# EAGLE design IOmodule (EAGLE 5.07)
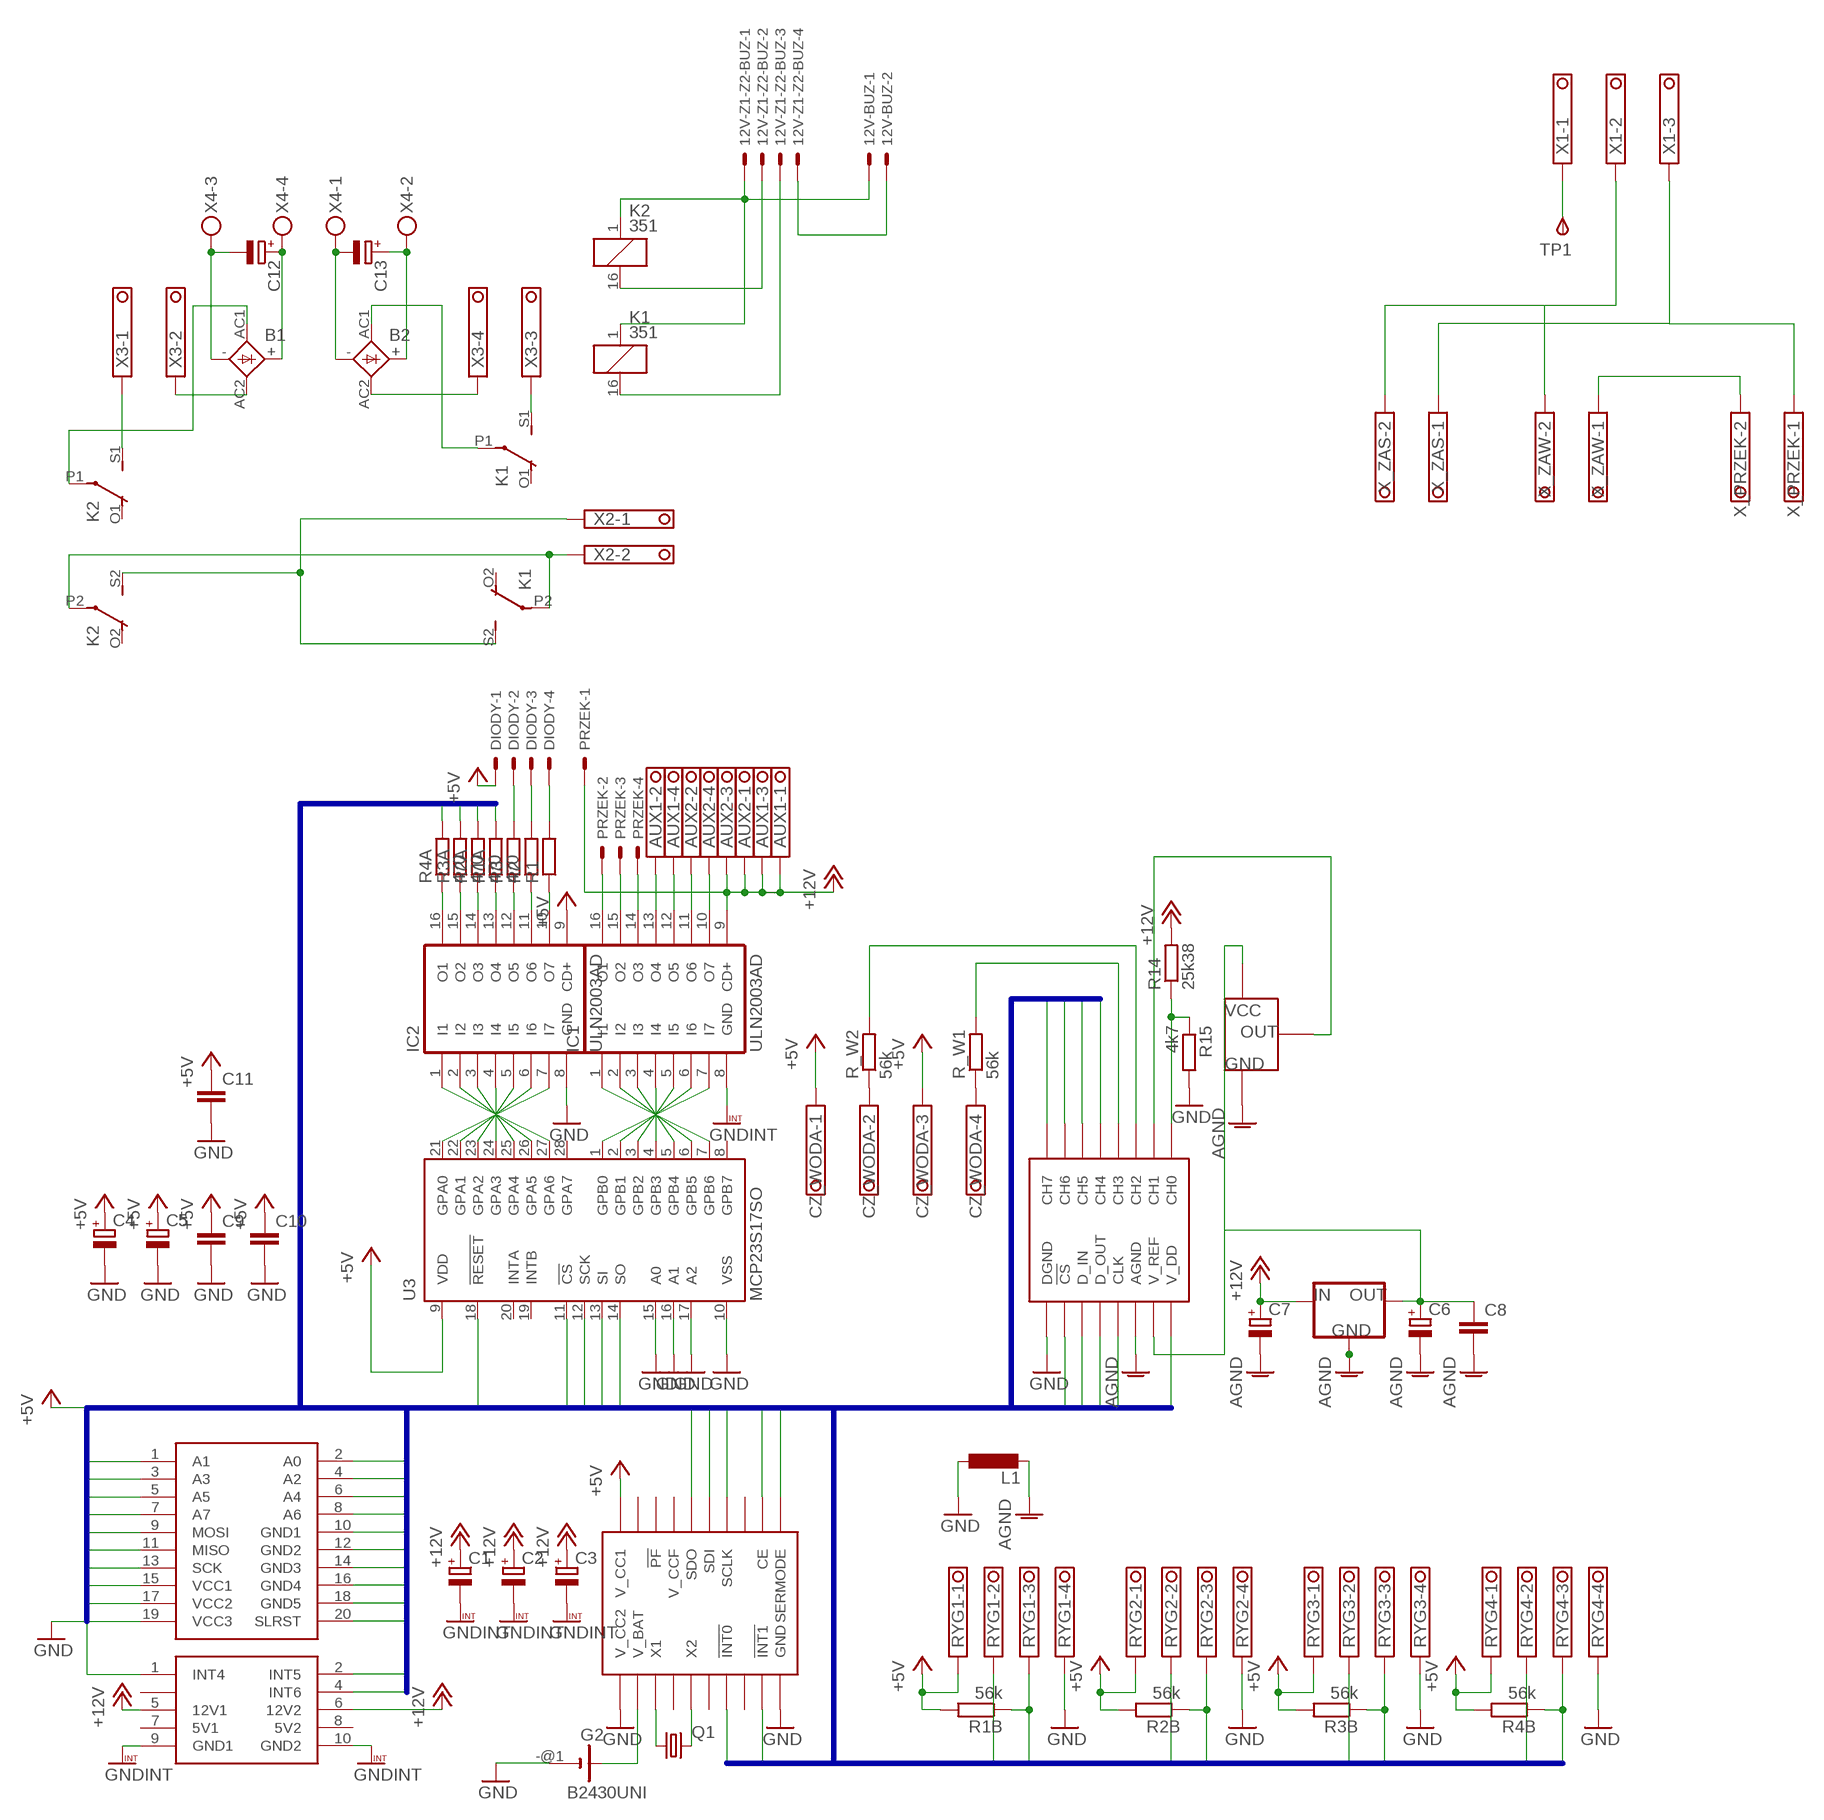
[diagram p0: schematic, sheet 1]

## Parts
12V-BUZ  22-23-2021  [22-23-2021]
12V-Z1-Z2-BUZ  22-23-2041  [22-23-2041]
AUX1  1751264  [1751264]
AUX2  1751264  [1751264]
B1  FB15  [FB15]
B2  FB15  [FB15]
C1  CPOL-EUE3.5-8  [E3,5-8]
C2  CPOL-EUE3.5-8  [E3,5-8]
C3  CPOL-EUE3.5-8  [E3,5-8]
C4  CPOL-EUC  [PANASONIC_C]
C5  CPOL-EUE3.5-8  [E3,5-8]
C6  CPOL-EUC  [PANASONIC_C]
C7  CPOL-EUC  [PANASONIC_C]
C8  C-EUC1206  [C1206]
C9  C-EUC1206  [C1206]
C10  C-EUC1206  [C1206]
C11  C-EUC1206  [C1206]
C12  CPOL-EUE5-13  [E5-13]
C13  CPOL-EUE5-13  [E5-13]
CZ_WODA  1751264  [1751264]
DIODY  22-23-2041  [22-23-2041]
EXT  MASTER_SPI_BUS  [ML20]
EXT2  MASTER_EXTERNAL  [ML10]
G2  B2430UNI  [B2430UNI]
IC1  ULN2003AD  [SO16]
IC2  ULN2003AD  [SO16]
K1  351  [351]
K2  351  [351]
L1  L-EUL2012C  [L2012C]
PRZEK  22-23-2041  [22-23-2041]
Q1  CRYSTALTC26H  [TC26H]
R1  R-EU_M3216  [M3216]
R1A  470  R-EU_R1206  [R1206]
R1B  56k  R-EU_R1206  [R1206]
R2  R-EU_M3216  [M3216]
R2A  470  R-EU_R1206  [R1206]
R2B  56k  R-EU_R1206  [R1206]
R3  R-EU_M3216  [M3216]
R3A  470  R-EU_R1206  [R1206]
R3B  56k  R-EU_R1206  [R1206]
R4A  470  R-EU_R1206  [R1206]
R4B  56k  R-EU_R1206  [R1206]
R14  25k38  R-EU_R1206  [R1206]
R15  4k7  R-EU_R1206  [R1206]
R_W1  56k  R-EU_R1206  [R1206]
R_W2  56k  R-EU_R1206  [R1206]
RTC  DS1305  [SSOP20]
RYG1  1751264  [1751264]
RYG2  1751264  [1751264]
RYG3  1751264  [1751264]
RYG4  1751264  [1751264]
S  LM35  [78LXX]
TP1  TPSPAD1-20  [P1-20]
U1  MCP3008  [SO16]
U2  78XXS08  [SO-08]
U3  MCP23S17SO  [SO28W]
X1  1751251  [1751251]
X2  1751248  [1751248]
X3  1751264  [1751264]
X4  MKDSN1,5/4-5,08  [MKDSN1,5/4-5,08]
X_PRZEK  1751248  [1751248]
X_ZAS  1751248  [1751248]
X_ZAW  1751248  [1751248]

## Nets
+5V: C4.+ C5.+ C9.1 C10.1 C11.1 CZ_WODA.1 CZ_WODA.3 DIODY.1 EXT.15(VCC1) EXT.17(VCC2) EXT.19(VCC3) IC2.9(CD+) R1B.2 R2B.2 R3B.2 R4B.2 RTC.11(SERMODE) RTC.20(V_CC1) RYG1.1 RYG2.1 RYG3.1 RYG4.1 U1.16(V_DD) U3.9(VDD)
+12V: AUX1.1 AUX1.3 AUX2.1 AUX2.3 C1.+ C2.+ C3.+ C7.+ EXT2.5(12V1) EXT2.6(12V2) IC1.9(CD+) PRZEK.1 R14.2 U2.8(IN)
A0: EXT.2(A0)
A1: EXT.1(A1)
A2: EXT.4(A2)
A3: EXT.3(A3)
A4: EXT.6(A4)
A5: EXT.5(A5) RTC.12(CE)
A5V: C6.+ C8.1 S.OUT(VCC) U1.15(V_REF) U2.1(OUT)
A6: EXT.8(A6) U1.10(!CS)
A7: EXT.7(A7) U3.11(!CS)
AC0: R14.1 R15.1 U1.1(CH0)
AC1: S.GND(OUT) U1.2(CH1)
AC2: R_W2.2 U1.3(CH2)
AC3: R_W1.2 U1.4(CH3)
AGND: C6.- C7.- C8.2 L1.2 S.IN(GND) U1.14(AGND) U2.2(GND1) U2.3(GND2) U2.6(GND) U2.7(GND3)
BUZZER_REL: IC1.14(O3) PRZEK.4
GND: C4.- C5.- C9.2 C10.2 C11.2 EXT.10(GND1) EXT.12(GND2) EXT.14(GND3) EXT.16(GND4) EXT.18(GND5) G2.-@1(-) IC2.8(GND) L1.1 R15.2 RTC.1(V_CC2) RTC.10(GND) RYG1.4 RYG2.4 RYG3.4 RYG4.4 U1.9(DGND) U3.10(VSS) U3.15(A0) U3.16(A1) U3.17(A2)
GNDINT: C1.- C2.- C3.- EXT2.9(GND1) EXT2.10(GND2) IC1.8(GND)
GPB0: IC1.7(I7) U3.1(GPB0)
GPB1: IC1.6(I6) U3.2(GPB1)
GPB2: IC1.5(I5) U3.3(GPB2)
GPB3: IC1.4(I4) U3.4(GPB3)
GPB4: IC1.3(I3) U3.5(GPB4)
GPB5: IC1.2(I2) U3.6(GPB5)
GPB6: IC1.1(I1) U3.7(GPB6)
INT4: EXT2.1(INT4) RTC.7(!INT0)
INT5: EXT2.2(INT5) RTC.9(!INT1)
INT6: EXT2.4(INT6)
MISO: EXT.11(MISO) RTC.16(SDO) U1.12(D_OUT) U3.14(SO)
MOSI: EXT.9(MOSI) RTC.15(SDI) U1.11(D_IN) U3.13(SI)
N$1: Q1.1 RTC.3(X1)
N$2: Q1.2 RTC.5(X2)
N$3: IC2.7(I7) U3.21(GPA0)
N$5: IC2.1(I1) U3.27(GPA6)
N$6: IC2.6(I6) U3.22(GPA1)
N$7: IC2.4(I4) U3.24(GPA3)
N$8: IC2.5(I5) U3.23(GPA2)
N$9: IC2.3(I3) U3.25(GPA4)
N$10: IC2.2(I2) U3.26(GPA5)
N$18: AUX1.2 IC1.13(O4)
N$19: AUX1.4 IC1.12(O5)
N$20: AUX2.2 IC1.11(O6)
N$21: AUX2.4 IC1.10(O7)
N$25: IC2.10(O7) R1.1
N$26: IC2.11(O6) R2.1
N$27: IC2.12(O5) R3.1
N$28: DIODY.4 R1.2
N$29: DIODY.3 R2.2
N$30: DIODY.2 R3.2
N$39: CZ_WODA.2 R_W2.1
N$40: CZ_WODA.4 R_W1.1
N$139: B1.AC2 X3.2
N$140: B2.AC2 X3.4
N$141: B1.- C12.- X4.3
N$142: B1.+ C12.+ X4.4
N$143: B2.- C13.- X4.1
N$144: B2.+ C13.+ X4.2
N$145: K1.S1(2:S) X3.3
N$146: B2.AC1 K1.P1(2:P)
N$147: K2.S1(2:S) X3.1
N$148: B1.AC1 K2.P1(2:P)
N$149: 12V-BUZ.1 12V-Z1-Z2-BUZ.1 K1.1 K2.1
N$150: 12V-Z1-Z2-BUZ.2 K2.16
N$151: 12V-Z1-Z2-BUZ.3 K1.16
N$152: K1.S2(3:S) K2.S2(3:S) X2.1
N$153: K1.P2(3:P) K2.P2(3:P) X2.2
N$154: 12V-BUZ.2 12V-Z1-Z2-BUZ.4
N$155: TP1.TP(PP) X1.1
N$156: X1.2 X_ZAS.2 X_ZAW.2
N$157: X1.3 X_PRZEK.1 X_ZAS.1
N$158: X_PRZEK.2 X_ZAW.1
RLK1: R1A.2 RYG1.2
RLK2: R2A.2 RYG2.2
RLK3: R3A.2 RYG3.2
RLK4: R4A.2 RYG4.2
RW1: R1B.1 RYG1.3 U1.8(CH7)
RW2: R2B.1 RYG2.3 U1.7(CH6)
RW3: R3B.1 RYG3.3 U1.6(CH5)
RW4: R4B.1 RYG4.3 U1.5(CH4)
SCK: EXT.13(SCK) RTC.14(SCLK) U1.13(CLK) U3.12(SCK)
SLRST: EXT.20(SLRST) U3.18(!RESET)
V_BAT: G2.+@4(+) RTC.2(V_BAT)
ZAW1_REL: IC1.16(O1) PRZEK.2
ZAW2_REL: IC1.15(O2) PRZEK.3
ZDR1: IC2.13(O4) R1A.1
ZDR2: IC2.14(O3) R2A.1
ZDR3: IC2.15(O2) R3A.1
ZDR4: IC2.16(O1) R4A.1
Unconnected: EXT2.3(NC) EXT2.7(5V1) EXT2.8(5V2) G2.- K1.O1(2:O) K1.O2(3:O) K2.O1(2:O) K2.O2(3:O) RTC.4(NC1) RTC.6(NC2) RTC.8(NC3) RTC.13(NC4) RTC.17(V_CCF) RTC.18(!PF) RTC.19(NC5) U3.8(GPB7) U3.19(INTB) U3.20(INTA) U3.28(GPA7)

## Buses
A[0..7],INT[4..6],MISO,MOSI,SCK,SLRST,GND,+5V,RLK[1..4],RW[1..4]

## Library data of the parts
12V-BUZ = con-molex:22-23-2021: .100" (2.54mm) Center Header - 2 Pin
12V-Z1-Z2-BUZ DIODY PRZEK = con-molex:22-23-2041: .100" (2.54mm) Center Header - 4 Pin
AUX1 AUX2 CZ_WODA RYG1-RYG4 X3 = con-phoenix-350:1751264: MKDS 1/ 4-3,5 Printklemme Nennstrom: 10 A Bemessungsspannung: 160 V Raster: 3,5 mm Polzahl: 4 Montageart: Löten Anschlussart: Schraubanschluss Anschlussrichtung vom Leiter zur Platine: 0° Source: http://eshop.phoenixcontact.com .. 1751264.pdf
B1 B2 = rectifier:FB15: FAGOR RECTIFIER grid 3 x 5 mm
C1-C7 C12 C13 = rcl:CPOL-EU: POLARIZED CAPACITOR, European symbol
C8-C11 = rcl:C-EU: CAPACITOR, European symbol
EXT = moje:MASTER_SPI_BUS: AtMega128 controller Spi Bus 1 A1 2 A0 3 A3 4 A2 5 A5 6 A4 7 A7 8 A6 9 MOSI 10 GND 11 MISO 12 GND 13 SCK 14 GND 15 VCC 16 GND 17 VCC 18 GND 19 VCC 20 RST
EXT2 = moje:MASTER_EXTERNAL
G2 = moje:B2430UNI: LI BATTERY
IC1 IC2 = uln-udn:ULN2003A: DRIVER ARRAY
K1 K2 = relay:351: RELAY 2 x switch, Omron
L1 = rcl:L-EU: INDUCTOR, European symbol
Q1 = crystal:CRYSTAL: CRYSTAL
R1 R1A R1B R2 R2A R2B R3 R3A R3B R4A R4B R14 R15 R_W1 R_W2 = rcl:R-EU_: RESISTOR, European symbol
RTC = moje:DS1305: I2C/Spi RTC with 96 bytes nvram.
S = moje:LM35
TP1 = testpad:TPS: TEST PIN
U1 = moje:MCP3008: 10bit 8 channel A/C with Spi interface.
U2 = moje:78XXS08
U3 = microchip:MCP23S17: http://ww1.microchip.com/downloads/en/DeviceDoc/21952a.pdf Source: http://ww1.microchip.com/downloads/en/DeviceDoc/21952a.pdf
X1 = con-phoenix-350:1751251: MKDS 1/ 3-3,5 Printklemme Nennstrom: 10 A Bemessungsspannung: 160 V Raster: 3,5 mm Polzahl: 3 Montageart: Löten Anschlussart: Schraubanschluss Anschlussrichtung vom Leiter zur Platine: 0° Source: http://eshop.phoenixcontact.com .. 1751251.pdf
X2 X_PRZEK X_ZAS X_ZAW = con-phoenix-350:1751248: MKDS 1/ 2-3,5 Printklemme Nennstrom: 10 A Bemessungsspannung: 160 V Raster: 3,5 mm Polzahl: 2 Montageart: Löten Anschlussart: Schraubanschluss Anschlussrichtung vom Leiter zur Platine: 0° Source: http://eshop.phoenixcontact.com .. 1751248.pdf
X4 = con-phoenix-508:MKDSN1,5/4-5,08: MKDSN 1,5/ 4-5,08 Printklemme Nennstrom: 13,5 A Nennspannung: 250 V Rastermaß: 5,08 mm Polzahl: 4 Anschlussart: Schraubanschluss Montage: Löten Anschlussrichtung Leiter/Platine: 0 ° Artikelnummer: 1729144 Source: http://eshop.phoenixcontact.com .. 1729144.pdf

## Board
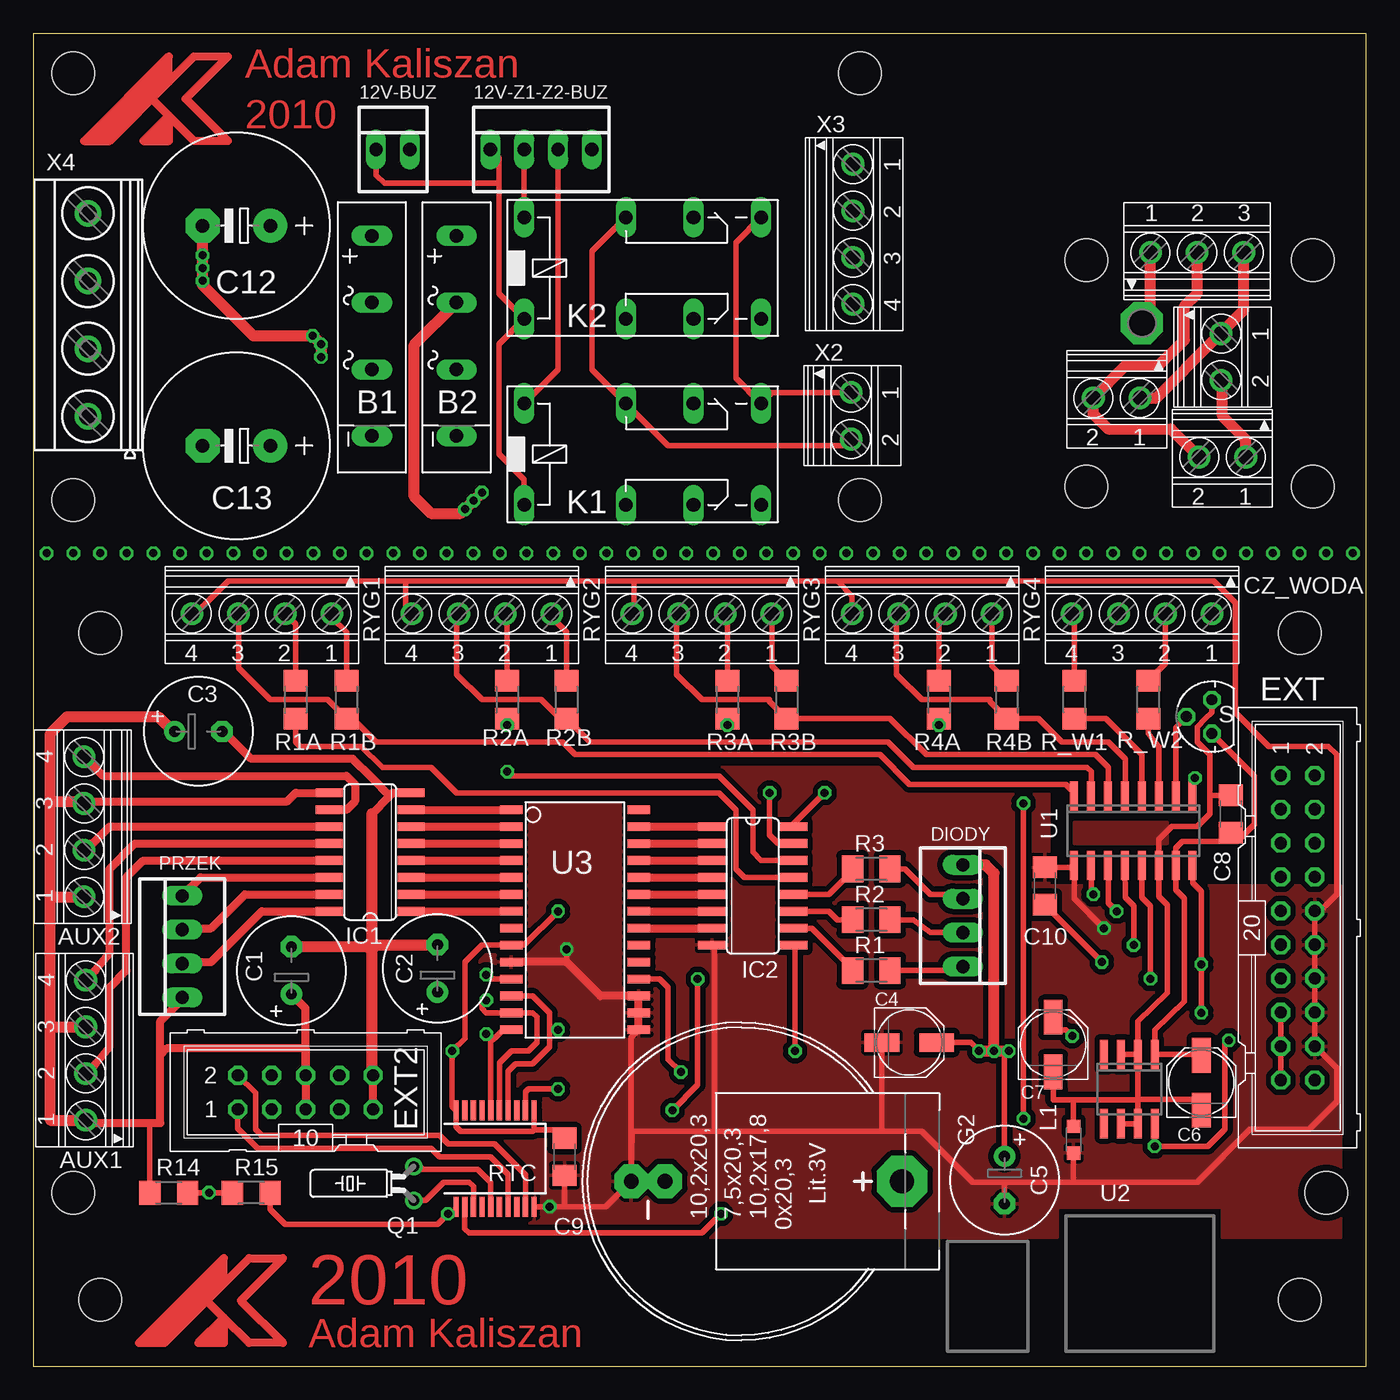
[diagram p1: board, top side]
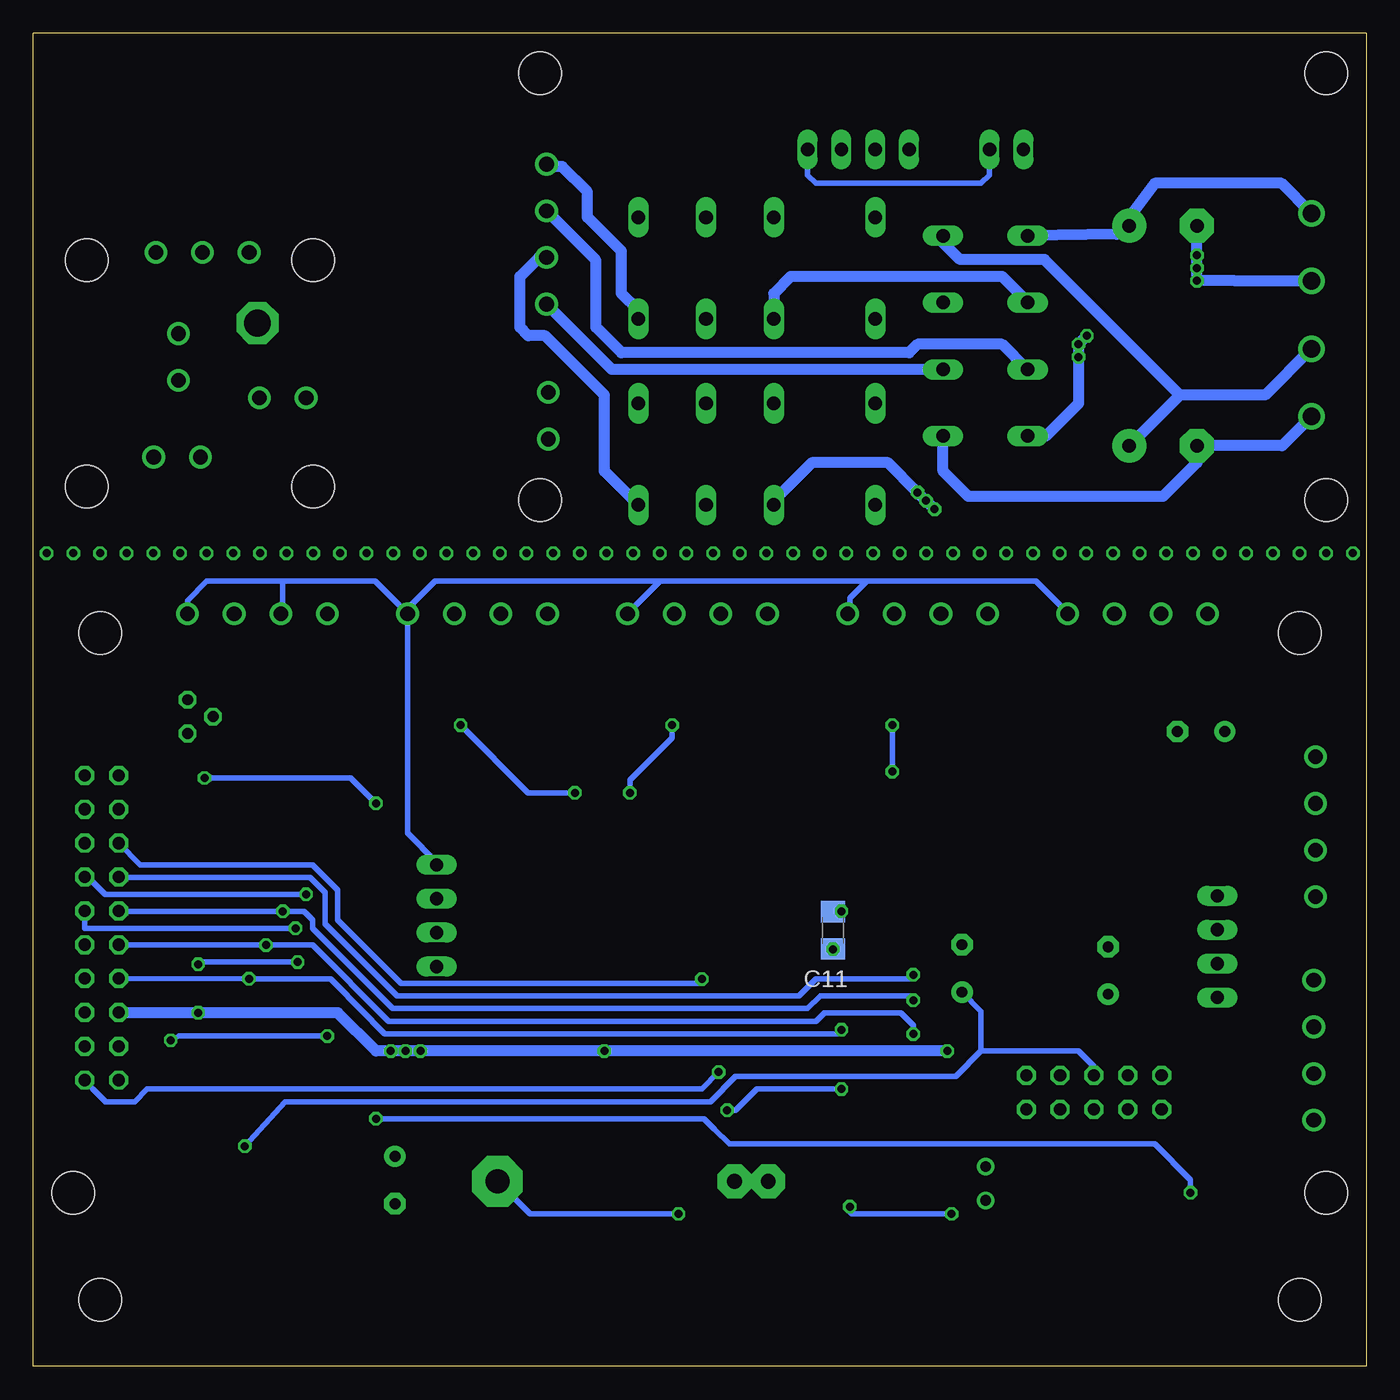
[diagram p2: board, bottom side, seen from below]

Size 100 x 100 mm. Coordinates in mm from the lower left corner, seen from the top.
Outline: 0,0 100,0 100,100 0,100 0,0
Copper layers (1*16): Top 0.035mm / dielectric 1.5mm / Bottom 0.035mm
Design rules "default *": minimum track width 8mil, minimum drill 16mil, track to track 8mil, track to pad 8mil, pad to pad 8mil, via to via 8mil, smd to smd 8mil, copper to edge 20mil, drill to drill 8mil, minimum pad ring 10mil, minimum via ring 8mil, stop-mask expansion 4mil, vias tented up to drill 0mil, thermal gap 10mil
Holes 3.2 mm at 3,13 5,55 95,55 97,13 5,5 95,5 3,65 62,65 3,97 62,97 96,66 96,83 79,83 79,66

### Footprints (pad centres in the part's own frame; a part is rotated, then mirrored left to right if it is on the bottom)
22-23-2021 = drill 1 long: 1 -1.27,0; 2 1.27,0
22-23-2041 = drill 1 long: 1 -3.81,0; 2 -1.27,0; 3 1.27,0; 4 3.81,0
1751264 = drill 1.1 pad 1.7 round: 1 -5.25,-0.1; 2 -1.75,-0.1; 3 1.75,-0.1; 4 5.25,-0.1
FB15 = drill 1.016 long: + -7.5,0; - 7.511,0; AC1 -2.496,0; AC2 2.533,0
E3,5-8 = drill 0.813 pad 1.6 round: + -1.778,0 | drill 0.813 pad 1.6 octagon: - 1.778,0
PANASONIC_C = smd 2.6 x 1.4: + 2.05,0; - -2.05,0
C1206 = smd 1.6 x 1.8: 1 -1.4,0; 2 1.4,0
E5-13 = drill 1.016 pad 2.54 round: + -2.54,0 | drill 1.016 pad 2.54 octagon: - 2.54,0
ML20 = drill 0.914 octagon: 1 -11.43,-1.27; 2 -11.43,1.27; 3 -8.89,-1.27; 4 -8.89,1.27; 5 -6.35,-1.27; 6 -6.35,1.27; 7 -3.81,-1.27; 8 -3.81,1.27; 9 -1.27,-1.27; 10 -1.27,1.27; 11 1.27,-1.27; 12 1.27,1.27; 13 3.81,-1.27; 14 3.81,1.27; 15 6.35,-1.27; 16 6.35,1.27; 17 8.89,-1.27; 18 8.89,1.27; 19 11.43,-1.27; 20 11.43,1.27
ML10 = drill 0.914 octagon: 1 -5.08,-1.27; 2 -5.08,1.27; 3 -2.54,-1.27; 4 -2.54,1.27; 5 0,-1.27; 6 0,1.27; 7 2.54,-1.27; 8 2.54,1.27; 9 5.08,-1.27; 10 5.08,1.27
B2430UNI = drill 1.803 pad 3.81 octagon: +@4 0,12.065 | drill 1.118 pad 2.54 octagon: - 0,-5.715; -@1 0,-8.255
SO16 = smd 0.66 x 2.032: 1 -4.445,-3.073; 2 -3.175,-3.073; 3 -1.905,-3.073; 4 -0.635,-3.073; 5 0.635,-3.073; 6 1.905,-3.073; 7 3.175,-3.073; 8 4.445,-3.073; 9 4.445,3.073; 10 3.175,3.073; 11 1.905,3.073; 12 0.635,3.073; 13 -0.635,3.073; 14 -1.905,3.073; 15 -3.175,3.073; 16 -4.445,3.073
351 = drill 1.016 long: 1 -3.81,-3.81; 16 -3.81,3.81; O1 8.89,-3.81; O2 8.89,3.81; P1 3.81,-3.81; P2 3.81,3.81; S1 13.97,-3.81; S2 13.97,3.81
L2012C = smd 1 x 1: 1 -1,0; 2 1,0
TC26H = drill 0.813 round: 1 -1.27,0; 2 1.27,0
M3216 = smd 1.6 x 2: 1 -1.4,0; 2 1.4,0
R1206 = smd 1.6 x 1.803: 1 -1.422,0; 2 1.422,0
SSOP20 = smd 0.4 x 1.5: 1 -2.925,-3.625; 2 -2.275,-3.625; 3 -1.625,-3.625; 4 -0.975,-3.625; 5 -0.325,-3.625; 6 0.325,-3.625; 7 0.975,-3.625; 8 1.625,-3.625; 9 2.275,-3.625; 10 2.925,-3.625; 11 2.925,3.625; 12 2.275,3.625; 13 1.625,3.625; 14 0.975,3.625; 15 0.325,3.625; 16 -0.325,3.625; 17 -0.975,3.625; 18 -1.625,3.625; 19 -2.275,3.625; 20 -2.925,3.625
78LXX = drill 0.813 octagon: GND 0,1.905; IN 1.27,0; OUT -1.27,0
P1-20 = drill 2.007 pad 3.15 octagon: TP 0,0
SO16' = smd 0.6 x 2.2: 1 -4.445,-2.6; 2 -3.175,-2.6; 3 -1.905,-2.6; 4 -0.635,-2.6; 5 0.635,-2.6; 6 1.905,-2.6; 7 3.175,-2.6; 8 4.445,-2.6; 9 4.445,2.6; 10 3.175,2.6; 11 1.905,2.6; 12 0.635,2.6; 13 -0.635,2.6; 14 -1.905,2.6; 15 -3.175,2.6; 16 -4.445,2.6
SO-08 = smd 0.6 x 2.2: 1 -1.905,-2.6; 2 -0.635,-2.6; 3 0.635,-2.6; 4 1.905,-2.6; 5 1.905,2.6; 6 0.635,2.6; 7 -0.635,2.6; 8 -1.905,2.6
SO28W = smd 0.65 x 1.7: 1 -7.62,-4.78; 2 -6.35,-4.78; 3 -5.08,-4.78; 4 -3.81,-4.78; 5 -2.54,-4.78; 6 -1.27,-4.78; 7 0,-4.78; 8 1.27,-4.78; 9 2.54,-4.78; 10 3.81,-4.78; 11 5.08,-4.78; 12 6.35,-4.78; 13 7.62,-4.78; 14 8.89,-4.78; 15 8.89,4.78; 16 7.62,4.78; 17 6.35,4.78; 18 5.08,4.78; 19 3.81,4.78; 20 2.54,4.78; 21 1.27,4.78; 22 0,4.78; 23 -1.27,4.78; 24 -2.54,4.78; 25 -3.81,4.78; 26 -5.08,4.78; 27 -6.35,4.78; 28 -7.62,4.78
1751251 = drill 1.1 pad 1.7 round: 1 -3.5,-0.1; 2 0,-0.1; 3 3.5,-0.1
1751248 = drill 1.1 pad 1.7 round: 1 -1.75,-0.1; 2 1.75,-0.1
MKDSN1,5/4-5,08 = drill 1.3 pad 2 round: 1 -7.641,0.025; 2 -2.561,0.025; 3 2.519,0.025; 4 7.599,0.025

### Placement (x,y rotation side)
12V-BUZ  26.99,91.28 0 top
12V-Z1-Z2-BUZ  38.1,91.28 0 top
AUX1  3.83,23.71 90 top
AUX2  3.7,40.47 90 top
B1  25.4,77.31 270 top
B2  31.75,77.31 270 top
C1  19.37,29.68 90 top
C2  30.32,29.84 90 top
C3  12.38,47.62 0 top
C4  65.72,24.29 0 top
C5  72.87,13.97 270 top
C6  87.63,21.27 90 top
C7  76.52,24.13 90 top
C8  89.85,41.43 90 top
C9  39.85,15.72 270 top
C10  75.88,36.03 90 top
C11  40.01,32.7 270 bottom
C12  15.24,85.56 180 top
C13  15.24,69.06 180 top
CZ_WODA  83.19,56.35 180 top
DIODY  69.74,33.8 270 top
EXT  94.86,32.89 270 top
EXT2  20.42,20.55 0 top
G2  53.12,13.87 270 top
IC1  25.28,38.58 90 top
IC2  53.98,36.03 270 top
K1  40.64,68.42 0 top
K2  40.64,82.39 0 top
L1  78.05,17 90 top
PRZEK  11.17,31.47 90 top
Q1  28.55,13.71 90 top
R1  62.87,29.68 0 top
R1A  19.68,50.01 90 top
R1B  23.5,50.01 90 top
R2  62.87,33.5 0 top
R2A  35.56,50.01 90 top
R2B  40.01,50.01 90 top
R3  62.87,37.3 0 top
R3A  52.07,50.01 90 top
R3B  56.52,50.01 90 top
R4A  67.94,50.01 90 top
R4B  73.03,50.01 90 top
R14  10.16,13.02 180 top
R15  16.35,13.02 0 top
R_W1  78.11,50.01 270 top
R_W2  83.66,50.01 270 top
RTC  34.64,15.58 0 top
RYG1  17.14,56.35 180 top
RYG2  33.66,56.35 180 top
RYG3  50.16,56.35 180 top
RYG4  66.67,56.35 180 top
S  88.42,48.73 90 top
TP1  83.19,78.26 0 top
U1  MCP3008  [SO16']  82.53,40.16 180 top
U2  82.23,20.8 180 top
U3  40.64,34.13 270 top
U$5  [LOGO]  14.29,2.38 0 top
U$6  [LOGO]  10.16,92.55 0 top
X1  87.31,83.66 0 top
X2  61.45,71.31 270 top
X3  61.59,84.93 270 top
X4  4.13,78.9 90 top
X_PRZEK  89.22,75.72 270 top
X_ZAS  81.28,72.55 180 top
X_ZAW  89.22,68.1 180 top

### Tracks (layer width: path | path; a pad name or v marks a point on that pad's centre or on a via)
+5V  (via drill 0.6)
  Top 0.406: 40.01,51.27 R2B.2 40.01,55.09 38.91,56.19 RYG2.1 | R1B.2 23.5,55.09 22.39,56.19 RYG1.1 | R3B.2 55.41,52.53 RYG3.1 | R4B.2 71.92,52.53 RYG4.1 | 37.57,17.72 RTC.11 | 37.57,17.72 37.47,17.62 32.07,17.62 31.72,17.97 RTC.20 31.43,19.5 v31.43,23.65 32.38,24.61 32.38,30.32 33.66,31.59 U3.9 36.83,31.59 v39.37,34.13 | EXT.19 EXT.17 EXT.15 | U1.16 87,36.27 87.63,35.64 v87.63,30.16 v87.63,26.51 | IC2.9 57.15,31.49 v57.15,23.65 | C4.+ 70.33,24.29 v70.96,23.65 | C5.+ 72.87,23.34 v73.18,23.65 | C10.1 75.88,34.61 v80.17,30.32 | 37.57,17.72 39.24,17.72 C9.1
  Top 0.813: DIODY.1 69.76,37.62 71.44,37.62 72.07,36.99 v72.07,23.65 | v70.96,23.65 v72.07,23.65 | v72.07,23.65 v73.18,23.65
  Bottom 0.406: RYG1.1 22.86,56.99 24.77,58.9 37.47,58.9 | 37.47,58.9 38.73,57.62 38.73,56.62 RYG2.1 | 52.98,58.9 RYG3.1 | 52.98,58.9 37.47,58.9 | RYG4.1 71.75,56.62 71.75,56.99 69.85,58.9 52.98,58.9 | RYG4.1 74.36,58.9 81.28,58.9 | 81.28,58.9 87,58.9 88.44,57.45 CZ_WODA.1 | CZ_WODA.3 81.28,56.61 81.28,58.9 | EXT.15 93.56,26.51 93.66,26.51 | RYG4.1 71.92,39.99 69.74,37.81 DIODY.1 | v80.17,30.32 87.47,30.32 v87.63,30.16 | v39.37,34.13 39.98,34.13 C11.1
  Bottom 0.813: 93.56,26.51 v87.63,26.51 77.15,26.51 74.3,23.65 v73.18,23.65 v72.07,23.65 v70.96,23.65 v57.15,23.65 v31.43,23.65
+12V  (via drill 0.6)
  Top 0.406: 20.43,23.87 20.32,23.76 20.32,21.75 | U2.8 v84.14,16.51 88.11,16.51 89.38,17.78 89.38,24.45 v89.69,24.45 | R14.2 8.74,18.09 8.57,18.26 | C7.+ 76.68,26.18 76.68,25.24 77.47,25.24 v77.95,24.76
  Top 0.61: IC1.9 19.68,43.02 19.05,42.38 3.96,42.38 AUX2.3 | EXT2.5 EXT2.6 20.43,23.87 | 9.53,23.34 9.53,18.26 8.57,18.26 4.13,18.26 AUX1.1 | 9.53,23.34 10.05,23.87 20.43,23.87 | PRZEK.1 11.17,27.52 9.53,25.88 9.53,23.34 | 20.43,23.87 20.43,26.85 C1.+
  Top 0.813: AUX1.1 1.27,18.46 1.27,25.46 | 1.27,25.46 1.27,35.22 | 1.27,42.38 3.8,42.38 AUX2.3 | 1.27,35.22 AUX2.1 | 1.27,35.22 1.27,42.38 | 1.27,25.46 AUX1.3 | C3.+ 10.48,47.62 9.37,48.73 2.54,48.73 1.27,47.47 1.27,42.38
  Bottom 0.406: v84.14,16.51 81.12,19.84 49.21,19.84 47.31,21.75 30.8,21.75 28.89,23.65 | 28.89,23.65 21.59,23.65 20.43,22.49 EXT2.6 | 28.89,23.65 28.89,26.64 C2.+ | v77.95,24.76 89.06,24.76 v89.69,24.45
A5  (via drill 0.6)
  Top 0.406: v49.85,29.05 49.85,21.11 v47.94,19.21 | v39.37,20.8 37.15,20.8 36.92,20.57 RTC.12
  Bottom 0.406: EXT.5 91.97,37.62 79.06,37.62 77.15,35.72 77.15,33.5 72.39,28.73 50.48,28.73 50.16,28.73 v49.85,29.05 | v47.94,19.21 47.31,19.21 45.72,20.8 v39.37,20.8
A5V
  Top 0.406: 89.85,39.37 86.2,39.37 85.7,38.87 U1.15 85.72,37.54 85.72,35.72 86.36,35.08 86.36,34.45 86.34,27.39 84.14,25.24 U2.1 87.63,23.39 C6.+ | 89.85,39.37 90.33,39.37 91.6,40.64 91.6,44.29 S.OUT | S.OUT | 89.85,39.37 C8.1
A6  (via drill 0.6)
  Top 0.406: U1.10 79.38,35.64 v79.53,35.4
  Bottom 0.406: v79.53,35.4 94.61,35.4 95.92,36.7 EXT.8
A7  (via drill 0.6)
  Top 0.406: v33.97,29.37 34.29,29.05 U3.11
  Bottom 0.406: EXT.7 93.56,36.67 79.22,36.67 78.11,35.56 78.11,33.18 72.71,27.78 42.55,27.78 41.27,29.05 34.29,29.05 v33.97,29.37
AC0  (via drill 0.6)
  Top 0.406: R14.1 v13.18,13.02 R15.1 | U1.1 86.97,43.79 v87.15,44.13 | v74.3,42.23 74.3,40 74.3,39.21 74.3,21.43 v74.3,18.57
  Bottom 0.406: v87.15,44.13 76.2,44.13 v74.3,42.23 | v74.3,18.57 49.69,18.57 48.9,17.78 | 48.9,17.78 | 48.9,17.78 47.78,16.67 15.88,16.67 13.18,13.97 v13.18,13.02
AC1
  Top 0.406: U1.2 85.7,47.92 S.GND
AC2
  Top 0.406: R_W2.2 83.66,48.73 83.66,47.47 84.14,46.83 84.45,46.51 84.45,43.97 84.43,43.95 U1.3
AC3
  Top 0.406: U1.4 83.19,43.42 83.19,45.88 80.48,48.58 R_W1.2
AGND
  Top 0.406: U2.2 82.87,25.88 85.07,28.02 85.09,32.7 85.09,34.61 84.45,35.24 84.45,37.54 U1.14 84.43,39.5 85.41,40.48 87.31,40.48 88.27,41.43 88.27,42.86 | U2.2 U2.3 | 82.87,20 82.87,19.68 U2.7 U2.6 | 82.87,20 U2.2 | L1.2 78.05,20 | 78.05,20 82.87,20 | 88.27,42.86 88.27,45.88 87.31,46.83 87.31,47.94 87.95,48.58 | 87.95,48.58 | 87.95,48.58 88.42,49.05 S.IN | S.IN | 78.05,20 76.52,20 C7.- | C6.- 87.15,19.22 87.15,20 82.87,20 | C8.2 88.29,42.83 88.27,42.86
  pour Top: 85.09,39.21 78.11,39.21 78.11,40.8 85.09,40.8
BUZZER_REL
  Top 0.61: IC1.14 12.55,36.67 PRZEK.4
GND  (via drill 0.6)
  Top 0.406: RYG1.4 11.79,56.35 12.06,56.35 14.61,58.9 27.94,58.9 | RYG2.4 27.94,56.92 27.94,58.9 | 45.09,58.9 27.94,58.9 | 60.33,58.9 45.09,58.9 | 60.33,58.9 61.42,57.8 RYG4.4 | RYG3.4 45.09,56.62 45.09,58.9 | G2.-@1 42.95,11.96 39.85,11.96 | RTC.10 v38.73,11.96 39.85,11.96 | 60.33,58.9 88.58,58.9 90.17,57.31 90.17,49.05 92.71,46.51 97.16,46.51 97.79,45.88 97.79,35.4 96.55,34.16 EXT.10 EXT.12 EXT.14 EXT.16 EXT.18 96.17,24 97.79,22.38 97.79,19.84 95.73,17.78 91.28,17.78 87.31,13.81 78.05,13.81 | G2.-@1 44.86,24.68 U3.15 | 51.12,17.62 44.92,17.62 G2.-@1 | 51.12,17.62 63.5,17.62 | 63.5,17.62 66.67,17.62 70.48,13.81 72.87,13.81 | 72.87,13.81 78.05,13.81 | v80.33,32.86 78.11,35.08 78.11,37.54 U1.9 77.95,37.44 C10.2 | 78.05,13.81 L1.1 | IC2.8 51.12,31.37 51.12,17.62 | RTC.1 31.59,11.52 v31.11,11.43 30.32,10.63 18.89,10.63 17.77,11.75 R15.2 | C4.- 63.67,17.79 63.5,17.62 | 72.87,13.81 C5.- | 39.85,11.96 C9.2 | 39.85,11.96 | 40.01,30.32 v40.01,31.27
  Top 0.61: U3.15 U3.16 U3.17 42.55,27.78 40.01,30.32 U3.10
  Bottom 0.406: v80.33,32.86 96.13,32.86 EXT.10 | v31.11,11.43 38.58,11.43 38.73,11.59 v38.73,11.96 | C11.2 39.98,31.46 v40.01,31.27
  pour Top (isolate 0.406): 33.66,44.92 33.34,9.68 76.83,9.68 76.83,11.9 89.22,11.9 89.22,9.68 98.11,9.68 98.11,36.03 76.2,36.03 76.2,44.92
GNDINT
  Top 0.406: EXT2.10 25.4,21.92
  Top 0.61: IC1.8 26.99,43.02 26.75,42.78 | 25.4,41.43 26.75,42.78 | EXT2.9 EXT2.10 | C3.- 14.29,47.62 16.35,45.56 23.97,45.56 25.4,44.13 26.75,42.78
  Top 0.813: 25.4,21.92 25.4,31.11 | 25.4,31.11 25.4,31.27 | 25.4,31.27 25.4,41.43 | C1.- 25.05,31.46 25.4,31.11 | C2.- 25.75,31.62 25.4,31.27
GPB0
  Top 0.61: IC1.7 U3.1
GPB1
  Top 0.61: IC1.6 U3.2
GPB2
  Top 0.61: IC1.5 U3.3
GPB3
  Top 0.61: IC1.4 U3.4
GPB4
  Top 0.61: IC1.3 U3.5
GPB5
  Top 0.61: IC1.2 U3.6
GPB6
  Top 0.61: IC1.1 U3.7
INT4
  Top 0.406: RTC.7 35.62,14.39 34.29,15.71 30.48,15.71 29.84,16.35 16.83,16.35 15.35,17.83 EXT2.1
INT5
  Top 0.406: RTC.9 36.92,14.36 34.61,16.67 31.11,16.67 30.48,17.3 17.14,17.3 16.67,17.78 16.67,20.49 EXT2.2
MISO  (via drill 0.6)
  Top 0.406: RTC.16 34.32,24.32 34.61,24.61 | 34.61,24.61 35.24,25.24 U3.14 | v33.97,24.92 34.29,24.61 34.61,24.61 | U1.12 81.92,35.16 82.55,34.52 v82.55,31.59
  Bottom 0.406: EXT.11 93.56,31.59 v82.55,31.59 79.06,31.59 73.34,25.88 41.27,25.88 40.64,26.51 34.92,26.51 33.97,25.56 v33.97,24.92
MOSI  (via drill 0.6)
  Top 0.406: RTC.15 34.97,22.74 35.88,23.65 37.15,23.65 37.78,24.29 37.78,26.19 37.47,26.51 U3.13 33.97,26.51 33.66,26.83 33.66,27.14 v33.97,27.46 | U1.11 80.64,37.54 80.64,34.77 v81.28,34.13
  Bottom 0.406: EXT.9 93.56,34.13 v81.28,34.13 79.69,34.13 79.06,33.5 79.06,32.86 73.03,26.83 41.91,26.83 40.96,27.78 34.29,27.78 v33.97,27.46
N$1
  Top 0.406: RTC.3 33.02,13.49 32.7,13.81 30.8,13.81 29.43,12.44 Q1.1
N$2
  Top 0.406: Q1.2 28.65,15.08 28.89,15.08 29.21,14.76 33.34,14.76 34.29,13.81 34.29,12.86 34.32,12.83 RTC.5
N$3
  Top 0.61: U3.21 IC2.7
N$5
  Top 0.61: U3.27 IC2.1
N$6
  Top 0.61: U3.22 IC2.6
N$7
  Top 0.61: U3.24 IC2.4
N$8
  Top 0.61: U3.23 IC2.5
N$9
  Top 0.61: U3.25 IC2.3
N$10
  Top 0.61: U3.26 IC2.2
N$18
  Top 0.61: IC1.13 8.26,37.94 6.99,36.67 6.99,29.68 5.71,28.41 5.71,23.97 4.67,22.7 AUX1.2
N$19
  Top 0.61: IC1.12 7.62,39.21 5.71,37.3 5.71,30.95 4.65,29.68 AUX1.4
N$20
  Top 0.61: IC1.11 5.71,40.48 4.45,39.21 4.29,39.21 AUX2.2
N$21
  Top 0.61: IC1.10 23.5,41.75 24.13,42.38 24.13,43.66 23.5,44.29 5.24,44.29 AUX2.4
N$25
  Top 0.406: IC2.10 58.42,32.86 61.47,29.82 R1.1
N$26
  Top 0.406: IC2.11 59.69,34.13 60.33,33.5 R2.1
N$27
  Top 0.406: IC2.12 59.69,35.4 61.47,37.17 R3.1
N$28
  Top 0.406: DIODY.4 69.44,29.68 R1.2
N$29
  Top 0.406: DIODY.3 67.31,32.53 66.04,33.5 64.14,33.5 64.27,33.36 R2.2
N$30
  Top 0.406: DIODY.2 69.41,35.4 67.31,35.4 65.41,37.3 R3.2
N$36  (via drill 0.6)
  other vias: 1,61
N$37  (via drill 0.6)
  other vias: 3,61
N$38  (via drill 0.6)
  other vias: 5,61
N$39
  Top 0.406: CZ_WODA.2 85.09,56.3 84.93,56.14 84.93,52.7 R_W2.1
N$40
  Top 0.406: CZ_WODA.4 78.11,56.28 R_W1.1
N$43  (via drill 0.6)
  other vias: 7,61
N$44  (via drill 0.6)
  other vias: 9,61
N$45  (via drill 0.6)
  other vias: 11,61
N$46  (via drill 0.6)
  other vias: 13,61
N$54  (via drill 0.6)
  other vias: 15,61
N$56  (via drill 0.6)
  other vias: 17,61
N$58  (via drill 0.6)
  other vias: 19,61
N$60  (via drill 0.6)
  other vias: 21,61
N$62  (via drill 0.6)
  other vias: 23,61
N$64  (via drill 0.6)
  other vias: 25,61
N$66  (via drill 0.6)
  other vias: 27,61
N$68  (via drill 0.6)
  other vias: 29,61
N$70  (via drill 0.6)
  other vias: 31,61
N$72  (via drill 0.6)
  other vias: 33,61
N$74  (via drill 0.6)
  other vias: 35,61
N$76  (via drill 0.6)
  other vias: 37,61
N$78  (via drill 0.6)
  other vias: 39,61
N$80  (via drill 0.6)
  other vias: 41,61
N$82  (via drill 0.6)
  other vias: 43,61
N$84  (via drill 0.6)
  other vias: 45,61
N$86  (via drill 0.6)
  other vias: 47,61
N$88  (via drill 0.6)
  other vias: 49,61
N$90  (via drill 0.6)
  other vias: 51,61
N$92  (via drill 0.6)
  other vias: 53,61
N$94  (via drill 0.6)
  other vias: 55,61
N$96  (via drill 0.6)
  other vias: 57,61
N$98  (via drill 0.6)
  other vias: 59,61
N$100  (via drill 0.6)
  other vias: 61,61
N$102  (via drill 0.6)
  other vias: 63,61
N$104  (via drill 0.6)
  other vias: 65,61
N$106  (via drill 0.6)
  other vias: 67,61
N$108  (via drill 0.6)
  other vias: 69,61
N$110  (via drill 0.6)
  other vias: 71,61
N$111  (via drill 0.6)
  other vias: 73,61
N$114  (via drill 0.6)
  other vias: 75,61
N$116  (via drill 0.6)
  other vias: 77,61
N$118  (via drill 0.6)
  other vias: 79,61
N$120  (via drill 0.6)
  other vias: 81,61
N$122  (via drill 0.6)
  other vias: 83,61
N$124  (via drill 0.6)
  other vias: 85,61
N$126  (via drill 0.6)
  other vias: 87,61
N$128  (via drill 0.6)
  other vias: 89,61
N$130  (via drill 0.6)
  other vias: 91,61
N$132  (via drill 0.6)
  other vias: 93,61
N$134  (via drill 0.6)
  other vias: 95,61
N$136  (via drill 0.6)
  other vias: 97,61
N$138  (via drill 0.6)
  other vias: 99,61
N$139
  Bottom 0.406: B1.AC2
  Bottom 0.813: B1.AC2 27.3,76.67 33.66,76.67 34.29,76.04 55.88,76.04 57.78,77.94 57.78,82.97 X3.2
N$140
  Bottom 0.813: B2.AC2 56.59,74.78 X3.4
N$141  (via drill 0.6)
  Top 0.813: C12.- v12.7,83.34 v12.7,82.39 v12.7,81.44 12.7,81.12 16.51,77.31 v20.95,77.31 v21.59,76.67 v21.59,75.72
  Bottom 0.813: B1.- 24.02,69.8 21.59,72.23 v21.59,75.72 v21.59,76.67 v20.95,77.31 | C12.- v12.7,81.44 | X4.3 9.82,81.42 9.84,81.44 v12.7,81.44 | v12.7,81.44 v12.7,83.34
N$142
  Bottom 0.813: X4.4 3.91,86.3 | 17.78,86.2 18.73,84.93 B1.+ | 17.78,86.2 15.88,88.74 6.35,88.74 X4.4 | 17.78,86.2 C12.+ | X4.4
N$143
  Bottom 0.813: B2.- 31.75,67.15 29.84,65.25 15.24,65.25 12.7,67.78 C13.- 6.3,69.06 X4.1
N$144
  Bottom 0.813: 13.97,72.87 C13.+ | B2.+ 31.75,84.3 30.48,83.03 24.13,83.03 13.97,72.87 | 13.97,72.87 7.57,72.87 X4.2
N$145
  Bottom 0.813: X3.3 62.08,83.18 63.5,81.75 63.5,77.94 62.87,77.31 61.59,77.31 57.15,72.87 57.15,67.15 K1.S1
N$146  (via drill 0.6)
  Top 0.813: v33.66,65.56 v33.02,64.93 v32.38,64.29 32.07,63.98 29.84,63.98 28.57,65.25 28.57,76.63 B2.AC1
  Bottom 0.813: K1.P1 44.45,64.93 41.59,67.78 35.88,67.78 v33.66,65.56 v32.38,64.29
N$147
  Bottom 0.813: K2.S1 54.61,79.22 55.88,80.48 55.88,83.66 58.42,86.2 58.42,88.11 60.33,90.01 61.33,90.01 X3.1
N$148
  Bottom 0.406: B1.AC1 25.4,79.85
  Bottom 0.813: 25.4,79.85 27.3,81.75 43.18,81.75 44.45,80.48 K2.P1
N$149
  Top 0.406: K1.1 36.83,66.52 34.92,68.42 34.92,76.67 K2.1 34.92,80.48 34.92,88.74 | 34.92,88.74 34.92,90.64 12V-Z1-Z2-BUZ.1 | 12V-BUZ.1 25.72,89.38 26.35,88.74 34.92,88.74
N$150
  Top 0.406: K2.16 12V-Z1-Z2-BUZ.2
N$151
  Top 0.406: 12V-Z1-Z2-BUZ.3 39.37,74.77 K1.16
N$152
  Top 0.406: K2.S2 52.7,84.3 52.7,74.14 K1.S2 55.44,73.06 X2.1
N$153
  Top 0.406: K2.P2 41.91,83.66 41.91,74.77 K1.P2 47.62,69.06 60.96,69.06 61.35,69.45 X2.2
N$154
  Bottom 0.406: 12V-BUZ.2 28.26,89.38 28.89,88.74 41.27,88.74 41.91,89.38 12V-Z1-Z2-BUZ.4
N$155
  Top 0.813: X1.1 83.81,78.89 TP1.TP
N$156
  Top 0.813: X1.2 87.31,80.48 86.36,79.53 86.36,76.99 84.45,75.09 81.97,75.09 X_ZAS.2 79.53,71.44 80.64,70.33 85.34,70.33 X_ZAW.2
N$157
  Top 0.813: X_ZAS.1 84.24,72.65 88.58,76.99 88.64,76.99 X_PRZEK.1 89.12,77.53 90.81,79.22 X1.3
N$158
  Top 0.813: X_ZAW.1 90.97,69.53 89.22,71.28 89.22,73.87 X_PRZEK.2
RLK1
  Top 0.406: R1A.2 19.68,55.66 RYG1.2
RLK2
  Top 0.406: R2A.2 35.56,56.3 RYG2.2
RLK3
  Top 0.406: R3A.2 52.07,56.3 RYG3.2
RLK4
  Top 0.406: R4A.2 67.94,55.98 RYG4.2
RW1
  Top 0.406: RYG1.3 15.39,52.39 17.78,50.01 22.07,50.01 R1B.1 23.66,48.42 24.13,48.42 25.72,46.83 39.69,46.83 40.64,45.88 63.5,45.88 65.72,43.66 77.47,43.66 78.08,43.04 U1.8
RW2
  Top 0.406: RYG2.3 31.85,56.45 31.75,56.35 31.75,51.91 33.66,50.01 38.1,50.01 39.37,48.73 39.85,48.73 R2B.1 41.76,46.83 64.14,46.83 66.04,44.92 79.06,44.92 79.38,44.61 79.38,43.26 U1.7
RW3
  Top 0.406: RYG3.3 48.41,55.88 48.26,55.72 48.26,51.91 50.16,50.01 55.24,50.01 55.24,49.85 R3B.1 64.29,48.58 66.99,45.88 79.69,45.88 80.64,44.92 80.64,42.78 U1.6
RW4
  Top 0.406: RYG4.3 64.92,55.88 64.77,55.72 64.77,51.91 66.67,50.01 71.75,50.01 71.75,49.85 R4B.1 75.4,48.58 77.15,46.83 80.64,46.83 81.92,45.56 81.92,42.94 U1.5
SCK  (via drill 0.6)
  Top 0.406: RTC.14 35.62,22.12 36.2,22.7 37.47,22.7 38.73,23.97 38.73,25.24 | 38.73,25.24 38.73,26.51 37.47,27.78 U3.12 | 38.73,25.24 v39.37,25.24 | U1.13 83.19,35.16 83.82,34.52 83.82,34.13 v83.82,29.07
  Bottom 0.406: 78.11,29.06 v83.82,29.07 | v83.82,29.07 EXT.13 | v39.37,25.24 39.69,24.92 73.66,24.92 77.37,28.73 77.69,29.06 78.11,29.06 | v83.82,29.07 v83.81,29.06 78.11,29.06
SLRST  (via drill 0.6)
  Top 0.406: v48.58,22.06 47.62,23.02 47.62,28.41 46.99,29.05 U3.18
  Bottom 0.406: EXT.20 95.53,20.8 94.61,19.88 94.61,19.84 92.39,19.84 91.44,20.8 49.85,20.8 v48.58,22.06
V_BAT  (via drill 0.6)
  Top 0.406: RTC.2 32.37,10.3 32.7,10 50.16,10 v51.59,11.43
  Bottom 0.406: v51.59,11.43 62.73,11.43 G2.+@4
ZAW1_REL
  Top 0.61: IC1.16 17.14,34.13 13.34,30.32 11.28,30.32 PRZEK.2
ZAW2_REL
  Top 0.61: IC1.15 15.88,35.4 13.34,32.86 11.28,32.86 PRZEK.3
ZDR1
  Top 0.406: IC2.13 53.34,36.67 52.7,37.3 52.7,41.75 51.44,43.02 31.75,43.02 29.84,44.92 26.19,44.92 24.61,46.51 20,46.51 19.68,46.83 R1A.1
ZDR2  (via drill 0.6)
  Top 0.406: IC2.14 54.61,37.94 53.98,38.58 53.98,41.75 51.44,44.29 35.88,44.29 v35.56,44.61 | v35.56,48.1 R2A.1
  Bottom 0.406: v35.56,44.61 v35.56,48.1
ZDR3  (via drill 0.6)
  Top 0.406: IC2.15 55.88,39.21 55.24,39.84 v55.24,43.02 | v52.07,48.1 R3A.1
  Bottom 0.406: v55.24,43.02 55.24,43.97 52.07,47.15 v52.07,48.1
ZDR4  (via drill 0.6)
  Top 0.406: IC2.16 57.05,40.7 v59.37,43.02 | v67.94,48.1 R4A.1
  Bottom 0.406: v59.37,43.02 62.87,43.02 v67.94,48.1

### Text on the board
Top: Adam Kaliszan | 2010 | 2010 | Adam Kaliszan
tDocu: Ryg X | - | + | - | AUX | + | GND | A IN | Wy | 5V